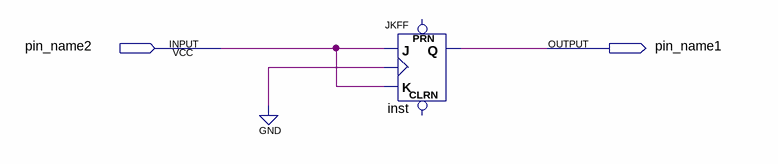
[diagram p0: schematic sheet]
// Quartus schematic Memoria4bits.bdf as structural Verilog: 1 symbols, 2 pins
module Memoria4bits (
  input  pin_name2,
  output pin_name1
);

  JKFF inst (.K(pin_name2), .J(pin_name2), .CLK(1'b0), .Q(pin_name1));  // open: PRN, CLRN
endmodule
